# Altium schematic sheet 11_Fun.SchDoc
size A4; Organization: OLTEST; Revision: 01; SheetNumber: 11; SheetTotal: 13; Название листа: Название листа; Разработчик: Бондарчук С.; Прибор: R100; АМАК.000000.000 Э3: R100.230.030.000-00; Дата: 16.04.2019; Формат: A4; workspacename: R100_Boards_v1
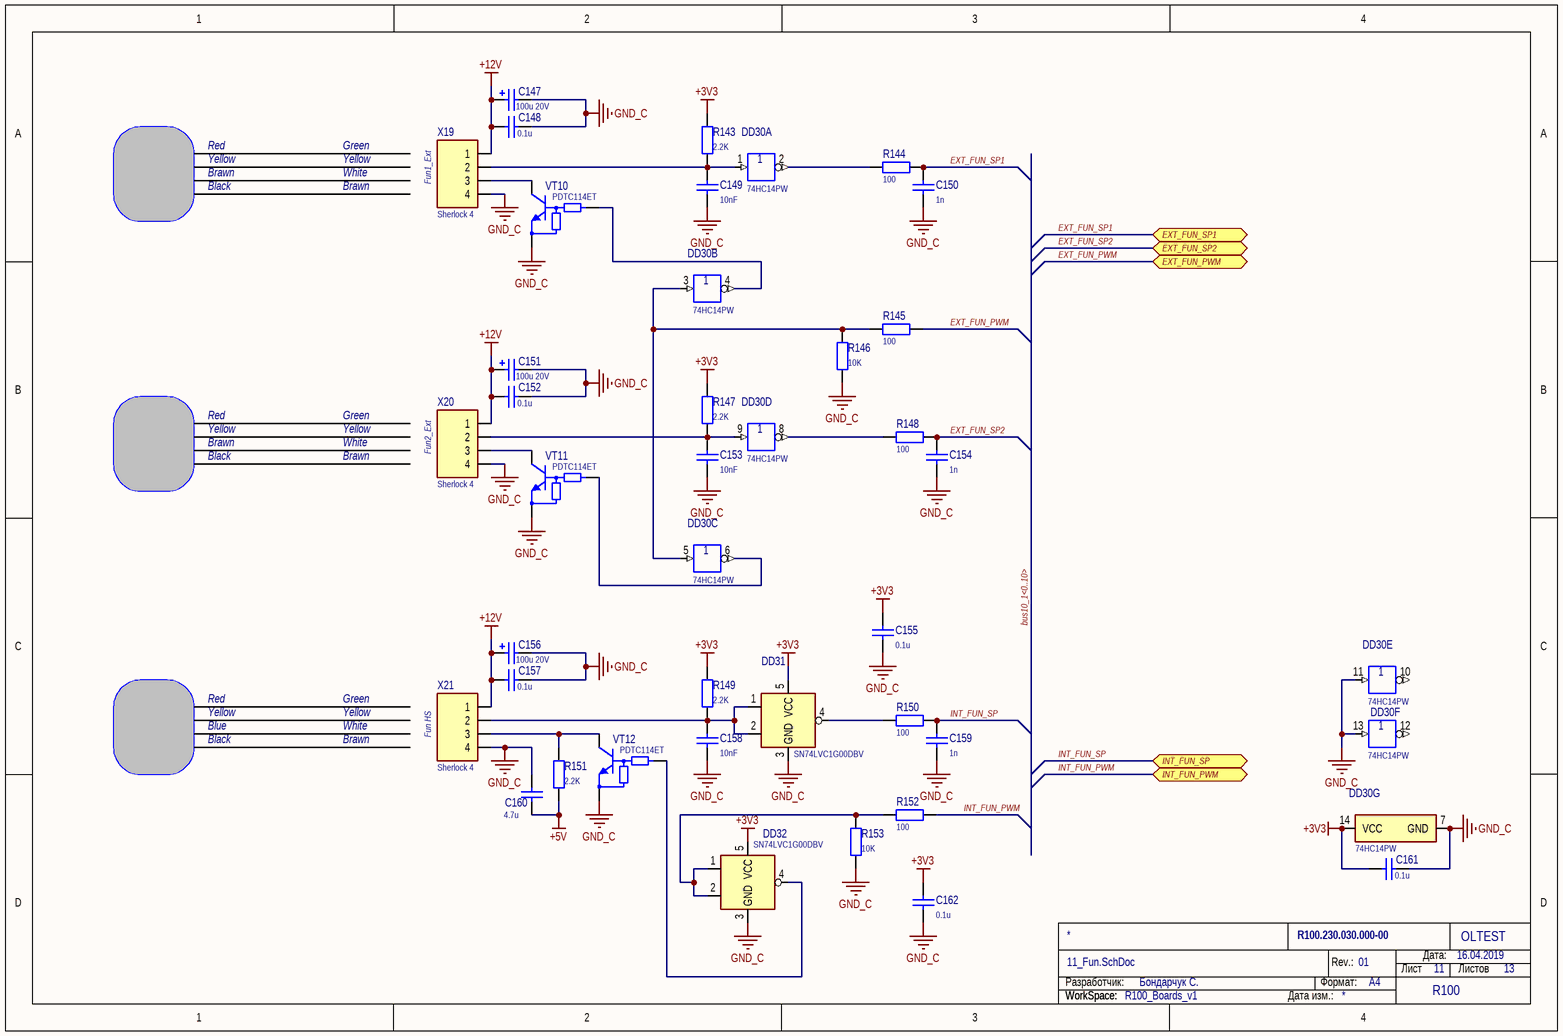
[diagram p0: 11_Fun.SchDoc]

## Parts
C147  100u 20V  [TAJD]
C148  0.1u  [SMD_C_0603]
C149  10nF  [SMD_C_0603]
C150  1n  [SMD_C_0603]
C151  100u 20V  [TAJD]
C152  0.1u  [SMD_C_0603]
C153  10nF  [SMD_C_0603]
C154  1n  [SMD_C_0603]
C155  0.1u  [SMD_C_0603]
C156  100u 20V  [TAJD]
C157  0.1u  [SMD_C_0603]
C158  10nF  [SMD_C_0603]
C159  1n  [SMD_C_0603]
C160  4.7u  [SMD_C_0805]
C161  0.1u  [SMD_C_0603]
C162  0.1u  [SMD_C_0603]
DD30  74HC14PW  [TSSOP14]  (parts A,B,C,D,E,F,G of 7)
DD31  SN74LVC1G00DBV  [SOT-23(DBV)]
DD32  SN74LVC1G00DBV  [SOT-23(DBV)]
R143  2.2K  [SMD_R_0603]
R144  100  [SMD_R_0603]
R145  100  [SMD_R_0603]
R146  10K  [SMD_R_0603]
R147  2.2K  [SMD_R_0603]
R148  100  [SMD_R_0603]
R149  2.2K  [SMD_R_0603]
R150  100  [SMD_R_0603]
R151  2.2K  [SMD_R_0603]
R152  100  [SMD_R_0603]
R153  10K  [SMD_R_0603]
VT10  PDTC114ET  [SOT23-3]
VT11  PDTC114ET  [SOT23-3]
VT12  PDTC114ET  [SOT23-3]
X19  Sherlock 4  [35362-0450]
X20  Sherlock 4  [35362-0450]
X21  Sherlock 4  [35362-0450]

## Ports
EXT_FUN_PWM, EXT_FUN_SP1, EXT_FUN_SP2, INT_FUN_PWM, INT_FUN_SP

## Nets
+3V3: C155.2 C161.1 C162.2 DD30.14(VCC) DD31.5(VCC) DD32.5(VCC) R143.2 R147.2 R149.2
+5V: C160.1 R151.1
+12V: C147.1 C148.1 C151.1 C152.1 C156.1 C157.1 X19.1 X20.1 X21.1
GND_C: C147.2 C148.2 C149.2 C150.1 C151.2 C152.2 C153.2 C154.1 C155.1 C156.2 C157.2 C158.2 C159.1 C160.2 C161.2 C162.1 DD30.7(GND) DD30.11(5A) DD30.13(6A) DD31.3(GND) DD32.3(GND) R146.1 R153.1 VT10.2(E) VT11.2(E) VT12.2(E) X19.4 X20.4 X21.4
EXT_FUN_PWM: R145.2 ; port EXT_FUN_PWM
EXT_FUN_SP1: C150.2 R144.2 ; port EXT_FUN_SP1
EXT_FUN_SP2: C154.2 R148.2 ; port EXT_FUN_SP2
INT_FUN_PWM: R152.2 ; port INT_FUN_PWM
INT_FUN_SP: C159.2 R150.2 ; port INT_FUN_SP
NetC149_1: C149.1 DD30.1(1A) R143.1 X19.2
NetC153_1: C153.1 DD30.9(4A) R147.1 X20.2
NetC158_1: C158.1 DD31.1 DD31.2 R149.1 X21.2
NetDD30_2: DD30.2(1Y) R144.1
NetDD30_3: DD30.3(2A) DD30.5(3A) R145.1 R146.2
NetDD30_4: DD30.4(2Y) VT10.1(B)
NetDD30_6: DD30.6(3Y) VT11.1(B)
NetDD30_8: DD30.8(4Y) R148.1
NetDD31_4: DD31.4 R150.1
NetDD32_1: DD32.1 DD32.2 R152.1 R153.2
NetDD32_4: DD32.4 VT12.1(B)
NetR151_2: R151.2 VT12.3(C) X21.3
NetVT10_3: VT10.3(C) X19.3
NetVT11_3: VT11.3(C) X20.3

Not connected (* = marked no-connect by the designer): DD30 10(5Y) 12(6Y)

## Buses and harness runs
bus bus10_1<0..10>

## Notes on the sheet
- Red
- Yellow
- Brawn
- Green
- White
- (near X19) Fun1_Ext
- Black
- (near X20) Fun2_Ext
- Blue
- (near X21) Fun HS
- Разработчик:
- Формат:
- Rev.:
- Лист
- Дата:
- Листов
- WorkSpace:
- Дата изм.:
- (in symbol SN74LVC1G00DBV) &

## Library data of the parts
C147 C151 C156 = TECAP 100u 20V 10%: SMD SIZE D TANTALUM AVX 20V 10%; PartNumber: TAJD107K020RNJ; Manufacturer: AVX; Value: 100u 20V
C148 C152 C155 C157 C161 C162 = C0603 0.1u 50V 10%: SMD C 0603 MURATA 50V 10% X7R; PartNumber: GRM188R71H104K; Manufacturer: MURATA; Value: 0.1u
C149 C153 C158 = C0603 10nF 100V 10%: SMD C 0603 MURATA 100V 10% X7R; PartNumber: GRJ188R72A103KE11#; Manufacturer: MURATA; Value: 10nF
C150 C154 C159 = C0603 1n 50V 5%: SMD C 0603 MURATA 50V 5% NP0; PartNumber: GRM1885C1H102JA01; Manufacturer: MURATA; Value: 1n
C160 = C0805 4.7u 25V 20%  X5R: SMD C 0805 MURATA 50V 5% NP0; PartNumber: GRM21BR61E475M; Manufacturer: MURATA; Value: 4.7u
DD30 = 74HC14: Quadruple 2-Input Positive-OR Gates, PW0014A; Manufacturer: Texas Instruments; PackageReference: PW0014A; PartNumber: 74HC14PW
DD31 DD32 = SN74LVC1G00DBV: 2-in NAND; Manufacturer: Texas Instruments; PartNumber: SN74LVC1G00DBV
R143 R147 R149 R151 = R0603 2.2K 1%: SMD R 0603 VISHAY 0.1W 75V 1% 100ppm; PartNumber: CRCW06032K20FK; Manufacturer: VISHAY; Value: 2.2K
R144 R145 R148 R150 R152 = R0603 100 1%: SMD R 0603 VISHAY 0.1W 75V 1% 100ppm; PartNumber: CRCW0603100RFK; Manufacturer: VISHAY; Value: 100
R146 R153 = R0603 10К 1%: SMD R 0603 VISHAY 0.1W 75V 1% 100ppm; PartNumber: CRCW060310K0FK; Manufacturer: VISHAY; Value: 10K
VT10-VT12 = PDTC114ET: Digital Transistor (BRT), R1=10 kOhm, R2=10 kOhm, NPN Transistor; Manufacturer: On Semiconductor; PartNumber: PDTC114ET
X19-X21 = 35362-0450: Sherlock 4 Top, 2A 125V 2mm; Manufacturer: MOLEX; PartNumber: 35362-0450